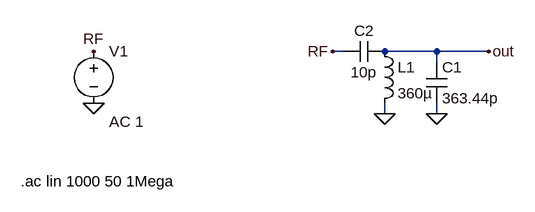
[diagram p0: schematic Draft1.asc]
Draft1.asc, the LTspice schematic file:
Version 4.1
SHEET 1 880 10740
WIRE -11856 10496 -11872 10496
WIRE -11712 10496 -11792 10496
WIRE -11632 10496 -11712 10496
WIRE -11712 10512 -11712 10496
WIRE -11792 10592 -11792 10576
WIRE -11712 10592 -11712 10576
FLAG -12240 10576 0
FLAG -12240 10496 RF
FLAG -11872 10496 RF
FLAG -11792 10592 0
FLAG -11712 10592 0
FLAG -11632 10496 out
SYMBOL voltage -12240 10480 R0
WINDOW 123 24 124 Left 2
WINDOW 39 0 0 Left 0
SYMATTR InstName V1
SYMATTR Value ""
SYMATTR Value2 AC 1
SYMBOL ind -11808 10480 R0
SYMATTR InstName L1
SYMATTR Value 360µ
SYMATTR SpiceLine Rser=1m
SYMBOL cap -11728 10512 R0
SYMATTR InstName C1
SYMATTR Value 363.44p
SYMBOL cap -11792 10480 R90
WINDOW 0 0 32 VBottom 2
WINDOW 3 32 32 VTop 2
SYMATTR InstName C2
SYMATTR Value 10p
TEXT -12352 10696 Left 2 !.ac lin 1000 50 1Mega

The netlist it stands for:
* Draft1.asc
V1 RF 0 AC 1
L1 out 0 360µ Rser=1m
C1 out 0 363.44p
C2 out RF 10p
.ac lin 1000 50 1Mega
.backanno
.end